# Altium schematic sheet Current_SenseSchematic.SchDoc (part 1 of 3)
size A2; SheetNumber: 1; SheetTotal: 1
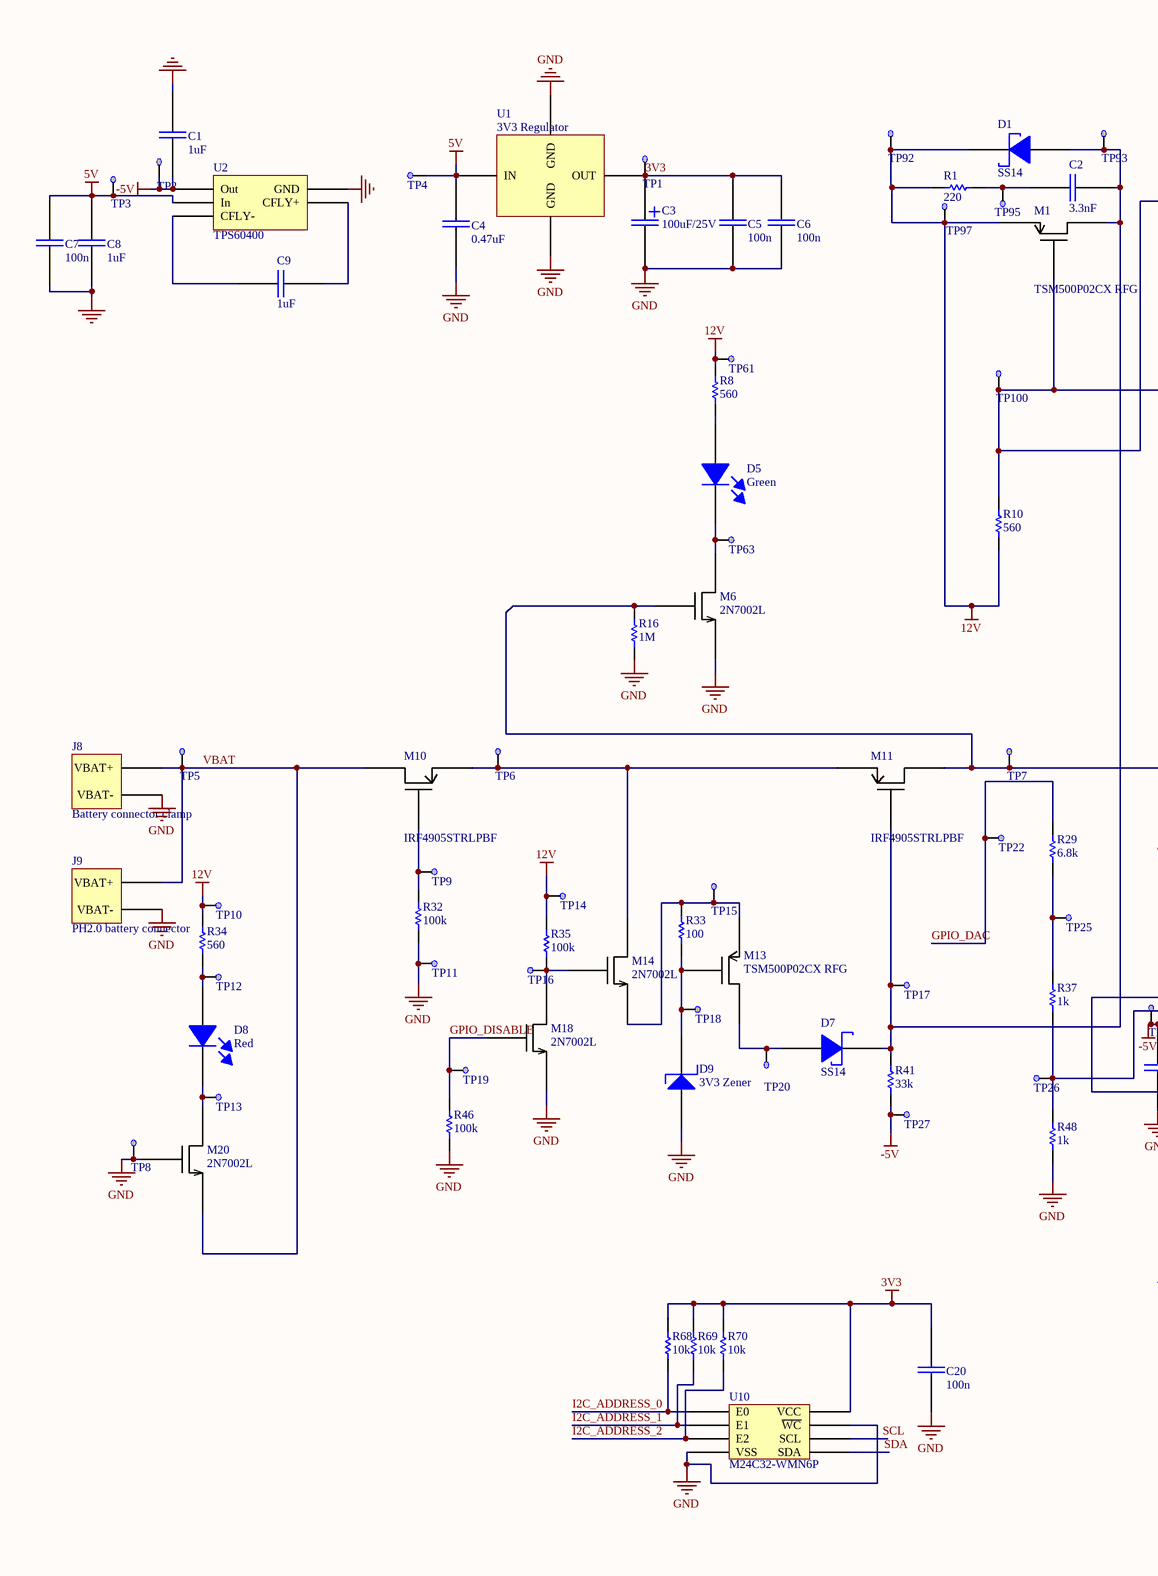
[diagram p0: Current_SenseSchematic.SchDoc, left]
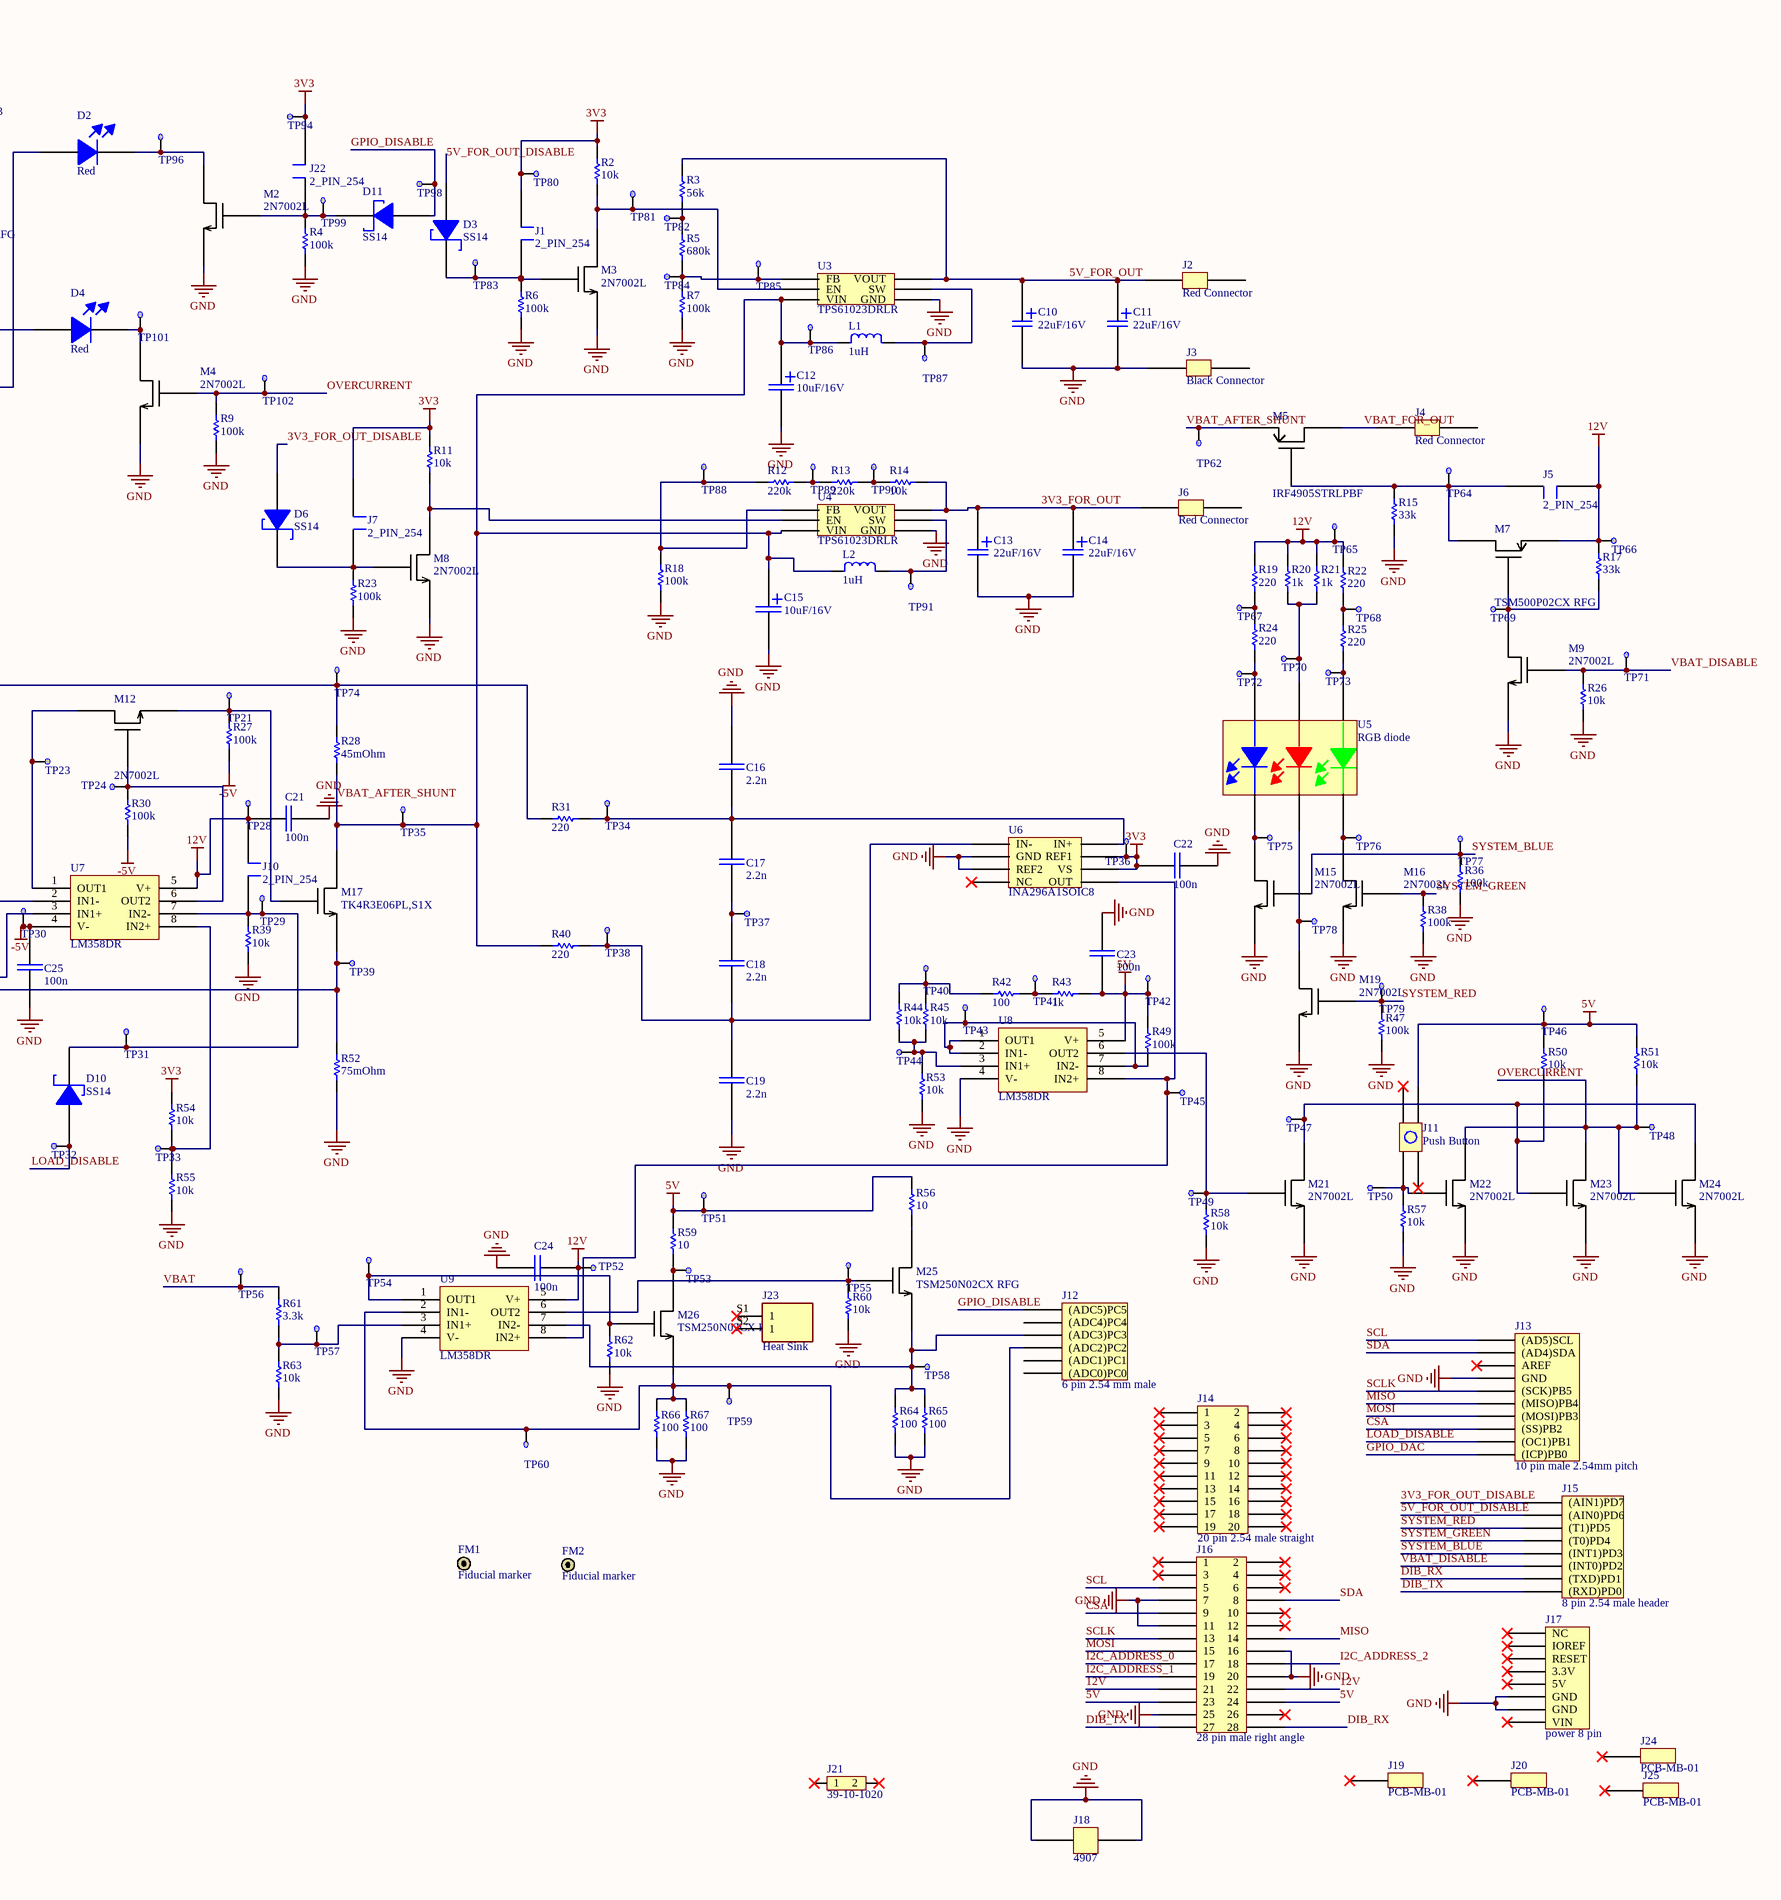
[diagram p1: Current_SenseSchematic.SchDoc, right]

## Parts
C1  1uF  [1206Capacitor]
C2  3.3nF  [1206Capacitor]
C3  100uF/25V  [CAPAE7366X60N]
C4  0.47uF  [1206Capacitor]
C5  100n  [1206Capacitor]
C6  100n  [1206Capacitor]
C7  100n  [1206Capacitor]
C8  1uF  [1206Capacitor]
C9  1uF  [1206Capacitor]
C10  22uF/16V  [22uF/16V]
C11  22uF/16V  [22uF/16V]
C12  10uF/16V  [10uF/16V Electrolytic]
C13  22uF/16V  [22uF/16V]
C14  22uF/16V  [22uF/16V]
C15  10uF/16V  [10uF/16V Electrolytic]
C16  2.2n  [1206Capacitor]
C17  2.2n  [1206Capacitor]
C18  2.2n  [1206Capacitor]
C19  2.2n  [1206Capacitor]
C20  100n  [1206Capacitor]
C21  100n  [1206Capacitor]
C22  100n  [1206Capacitor]
C23  100n  [1206Capacitor]
C24  100n  [1206Capacitor]
C25  100n  [1206Capacitor]
D1  SS14  [DIOM5026X23N]
D2  Red  [RED]
D3  SS14  [DIOM5026X23N]
D4  Red  [RED]
D5  Green  [Green]
D6  SS14  [DIOM5026X23N]
D7  SS14  [DIOM5026X23N]
D8  Red  [RED]
D9  3V3 Zener  [DIOMELF3515N]
D10  SS14  [DIOM5026X23N]
D11  SS14  [DIOM5026X23N]
FM1  Fiducial marker  [Fiducal Marker]  (net tie, no BOM)
FM2  Fiducial marker  [Fiducal Marker]  (net tie, no BOM)
J1  2_PIN_254  [2_PIN_2.54mm]
J2  Red Connector  [RED CONNECTOR]
J3  Black Connector  [BLACK CONNECTOR]
J4  Red Connector  [RED CONNECTOR]
J5  2_PIN_254  [2_PIN_2.54mm]
J6  Red Connector  [RED CONNECTOR]
J7  2_PIN_254  [2_PIN_2.54mm]
J8  Battery connector clamp  [2.54mm CLAMP connector]
J9  PH2.0 battery connector  [PH2.0 connector]
J10  2_PIN_254  [2_PIN_2.54mm]
J11  Push Button  [PUSH_BUTTON]
J12  6 pin 2.54 mm male  [6_pin_header_male_2_54]
J13  10 pin male 2.54mm pitch  [10_pin_header_male_2_54]
J14  20 pin 2.54 male straight  [20_pin_header_angled_female_2_54_mm]
J15  8 pin 2.54 male header  [8_pin_header_male_2_54]
J16  28 pin male right angle  [28_Pin_header_right_angle]
J17  power 8 pin  [8_pin_header_male_2_54]
J18  4907  [4907_footprint]
J19  PCB-MB-01  [PCB-MB-01]
J20  PCB-MB-01  [PCB-MB-01]
J21  39-10-1020  [39-30-1020]
J22  2_PIN_254  [2_PIN_2.54mm]
J23  Heat Sink  [HEAT_SINK]
J24  PCB-MB-01  [PCB-MB-01]
J25  PCB-MB-01  [PCB-MB-01]
L1  1uH  [PA4333_7.4x6.8x3.2mm]
L2  1uH  [PA4333_7.4x6.8x3.2mm]
M1  TSM500P02CX RFG  [SOT95P240X100-3N]
M2  2N7002L  [SOT95P240X100-3N]
M3  2N7002L  [SOT95P240X100-3N]
M4  2N7002L  [SOT95P240X100-3N]
M5  IRF4905STRLPBF  [DPAK254P1524X483-3L]
M6  2N7002L  [SOT95P240X100-3N]
M7  TSM500P02CX RFG  [SOT95P240X100-3N]
M8  2N7002L  [SOT95P240X100-3N]
M9  2N7002L  [SOT95P240X100-3N]
M10  IRF4905STRLPBF  [DPAK254P1524X483-3L]
M11  IRF4905STRLPBF  [DPAK254P1524X483-3L]
M12  2N7002L  [SOT95P240X100-3N]
M13  TSM500P02CX RFG  [SOT95P240X100-3N]
M14  2N7002L  [SOT95P240X100-3N]
M15  2N7002L  [SOT95P240X100-3N]
M16  2N7002L  [SOT95P240X100-3N]
M17  TK4R3E06PL,S1X  [TO-220-3]
M18  2N7002L  [SOT95P240X100-3N]
M19  2N7002L  [SOT95P240X100-3N]
M20  2N7002L  [SOT95P240X100-3N]
M21  2N7002L  [SOT95P240X100-3N]
M22  2N7002L  [SOT95P240X100-3N]
M23  2N7002L  [SOT95P240X100-3N]
M24  2N7002L  [SOT95P240X100-3N]
M25  TSM250N02CX RFG  [SOT95P240X100-3N]
M26  TSM250N02CX RFG  [SOT95P240X100-3N]
R1  220  [RESISTOR1206]
R2  10k  [RESISTOR1206]
R3  56k  [RESISTOR1206]
R4  100k  [RESISTOR1206]
R5  680k  [RESISTOR1206]
R6  100k  [RESISTOR1206]
R7  100k  [RESISTOR1206]
R8  560  [RESISTOR1206]
R9  100k  [RESISTOR1206]
R10  560  [RESISTOR1206]
R11  10k  [RESISTOR1206]
R12  220k  [RESISTOR1206]
R13  220k  [RESISTOR1206]
R14  10k  [RESISTOR1206]
R15  33k  [RESISTOR1206]
R16  1M  [RESISTOR1206]
R17  33k  [RESISTOR1206]
R18  100k  [RESISTOR1206]
R19  220  [RESISTOR1206]
R20  1k  [RESISTOR1206]
R21  1k  [RESISTOR1206]
R22  220  [RESISTOR1206]
R23  100k  [RESISTOR1206]
R24  220  [RESISTOR1206]
R25  220  [RESISTOR1206]
R26  10k  [RESISTOR1206]
R27  100k  [RESISTOR1206]
R28  45mOhm  [RESISTOR1206]
R29  6.8k  [RESISTOR1206]
R30  100k  [RESISTOR1206]
R31  220  [RESISTOR1206]
R32  100k  [RESISTOR1206]
R33  100  [RESISTOR1206]
R34  560  [RESISTOR1206]
R35  100k  [RESISTOR1206]
R36  100k  [RESISTOR1206]
R37  1k  [RESISTOR1206]
R38  100k  [RESISTOR1206]
R39  10k  [RESISTOR1206]
R40  220  [RESISTOR1206]
R41  33k  [RESISTOR1206]
R42  100  [RESISTOR1206]
R43  1k  [RESISTOR1206]
R44  10k  [RESISTOR1206]
R45  10k  [RESISTOR1206]
R46  100k  [RESISTOR1206]
R47  100k  [RESISTOR1206]
R48  1k  [RESISTOR1206]
R49  100k  [RESISTOR1206]
R50  10k  [RESISTOR1206]
R51  10k  [RESISTOR1206]
R52  75mOhm  [RESISTOR2512]
R53  10k  [RESISTOR1206]
R54  10k  [RESISTOR1206]
R55  10k  [RESISTOR1206]
R56  10  [RESISTOR1206]
R57  10k  [RESISTOR1206]
R58  10k  [RESISTOR1206]
R59  10  [RESISTOR1206]
R60  10k  [RESISTOR1206]
R61  3.3k  [RESISTOR1206]
R62  10k  [RESISTOR1206]
R63  10k  [RESISTOR1206]
R64  100  [RESISTOR1206]
R65  100  [RESISTOR1206]
R66  100  [RESISTOR1206]
R67  100  [RESISTOR1206]
R68  10k  [RESISTOR1206]
R69  10k  [RESISTOR1206]
R70  10k  [RESISTOR1206]
TP1  TestPoint  [TestPoint]  (value not drawn)  (net tie, no BOM)
TP2  TestPoint  [TestPoint]  (value not drawn)  (net tie, no BOM)
TP3  TestPoint  [TestPoint]  (value not drawn)  (net tie, no BOM)
TP4  TestPoint  [TestPoint]  (value not drawn)  (net tie, no BOM)
TP5  TestPoint  [TestPoint]  (value not drawn)  (net tie, no BOM)
TP6  TestPoint  [TestPoint]  (value not drawn)  (net tie, no BOM)
TP7  TestPoint  [TestPoint]  (value not drawn)  (net tie, no BOM)
TP8  TestPoint  [TestPoint]  (value not drawn)  (net tie, no BOM)
TP9  TestPoint  [TestPoint]  (value not drawn)  (net tie, no BOM)
TP10  TestPoint  [TestPoint]  (value not drawn)  (net tie, no BOM)
TP11  TestPoint  [TestPoint]  (value not drawn)  (net tie, no BOM)
TP12  TestPoint  [TestPoint]  (value not drawn)  (net tie, no BOM)
TP13  TestPoint  [TestPoint]  (value not drawn)  (net tie, no BOM)
TP14  TestPoint  [TestPoint]  (value not drawn)  (net tie, no BOM)
TP15  TestPoint  [TestPoint]  (value not drawn)  (net tie, no BOM)
TP16  TestPoint  [TestPoint]  (value not drawn)  (net tie, no BOM)
TP17  TestPoint  [TestPoint]  (value not drawn)  (net tie, no BOM)
TP18  TestPoint  [TestPoint]  (value not drawn)  (net tie, no BOM)
TP19  TestPoint  [TestPoint]  (value not drawn)  (net tie, no BOM)
TP20  TestPoint  [TestPoint]  (value not drawn)  (net tie, no BOM)
TP21  TestPoint  [TestPoint]  (value not drawn)  (net tie, no BOM)
TP22  TestPoint  [TestPoint]  (value not drawn)  (net tie, no BOM)
TP23  TestPoint  [TestPoint]  (value not drawn)  (net tie, no BOM)
TP24  TestPoint  [TestPoint]  (value not drawn)  (net tie, no BOM)
TP25  TestPoint  [TestPoint]  (value not drawn)  (net tie, no BOM)
TP26  TestPoint  [TestPoint]  (value not drawn)  (net tie, no BOM)
TP27  TestPoint  [TestPoint]  (value not drawn)  (net tie, no BOM)
TP28  TestPoint  [TestPoint]  (value not drawn)  (net tie, no BOM)
TP29  TestPoint  [TestPoint]  (value not drawn)  (net tie, no BOM)
TP30  TestPoint  [TestPoint]  (value not drawn)  (net tie, no BOM)
TP31  TestPoint  [TestPoint]  (value not drawn)  (net tie, no BOM)
TP32  TestPoint  [TestPoint]  (value not drawn)  (net tie, no BOM)
TP33  TestPoint  [TestPoint]  (value not drawn)  (net tie, no BOM)
TP34  TestPoint  [TestPoint]  (value not drawn)  (net tie, no BOM)
TP35  TestPoint  [TestPoint]  (value not drawn)  (net tie, no BOM)
TP36  TestPoint  [TestPoint]  (value not drawn)  (net tie, no BOM)
TP37  TestPoint  [TestPoint]  (value not drawn)  (net tie, no BOM)
TP38  TestPoint  [TestPoint]  (value not drawn)  (net tie, no BOM)
TP39  TestPoint  [TestPoint]  (value not drawn)  (net tie, no BOM)
TP40  TestPoint  [TestPoint]  (value not drawn)  (net tie, no BOM)
TP41  TestPoint  [TestPoint]  (value not drawn)  (net tie, no BOM)
TP42  TestPoint  [TestPoint]  (value not drawn)  (net tie, no BOM)
TP43  TestPoint  [TestPoint]  (value not drawn)  (net tie, no BOM)
TP44  TestPoint  [TestPoint]  (value not drawn)  (net tie, no BOM)
TP45  TestPoint  [TestPoint]  (value not drawn)  (net tie, no BOM)
TP46  TestPoint  [TestPoint]  (value not drawn)  (net tie, no BOM)
TP47  TestPoint  [TestPoint]  (value not drawn)  (net tie, no BOM)
TP48  TestPoint  [TestPoint]  (value not drawn)  (net tie, no BOM)
TP49  TestPoint  [TestPoint]  (value not drawn)  (net tie, no BOM)
TP50  TestPoint  [TestPoint]  (value not drawn)  (net tie, no BOM)
TP51  TestPoint  [TestPoint]  (value not drawn)  (net tie, no BOM)
TP52  TestPoint  [TestPoint]  (value not drawn)  (net tie, no BOM)
TP53  TestPoint  [TestPoint]  (value not drawn)  (net tie, no BOM)
TP54  TestPoint  [TestPoint]  (value not drawn)  (net tie, no BOM)
TP55  TestPoint  [TestPoint]  (value not drawn)  (net tie, no BOM)
TP56  TestPoint  [TestPoint]  (value not drawn)  (net tie, no BOM)
TP57  TestPoint  [TestPoint]  (value not drawn)  (net tie, no BOM)
TP58  TestPoint  [TestPoint]  (value not drawn)  (net tie, no BOM)
TP59  TestPoint  [TestPoint]  (value not drawn)  (net tie, no BOM)
TP60  TestPoint  [TestPoint]  (value not drawn)  (net tie, no BOM)
TP61  TestPoint  [TestPoint]  (value not drawn)  (net tie, no BOM)
TP62  TestPoint  [TestPoint]  (value not drawn)  (net tie, no BOM)
TP63  TestPoint  [TestPoint]  (value not drawn)  (net tie, no BOM)
TP64  TestPoint  [TestPoint]  (value not drawn)  (net tie, no BOM)
TP65  TestPoint  [TestPoint]  (value not drawn)  (net tie, no BOM)
TP66  TestPoint  [TestPoint]  (value not drawn)  (net tie, no BOM)
TP67  TestPoint  [TestPoint]  (value not drawn)  (net tie, no BOM)
TP68  TestPoint  [TestPoint]  (value not drawn)  (net tie, no BOM)
TP69  TestPoint  [TestPoint]  (value not drawn)  (net tie, no BOM)
TP70  TestPoint  [TestPoint]  (value not drawn)  (net tie, no BOM)
TP71  TestPoint  [TestPoint]  (value not drawn)  (net tie, no BOM)
TP72  TestPoint  [TestPoint]  (value not drawn)  (net tie, no BOM)
TP73  TestPoint  [TestPoint]  (value not drawn)  (net tie, no BOM)
TP74  TestPoint  [TestPoint]  (value not drawn)  (net tie, no BOM)
TP75  TestPoint  [TestPoint]  (value not drawn)  (net tie, no BOM)
TP76  TestPoint  [TestPoint]  (value not drawn)  (net tie, no BOM)
TP77  TestPoint  [TestPoint]  (value not drawn)  (net tie, no BOM)
TP78  TestPoint  [TestPoint]  (value not drawn)  (net tie, no BOM)
TP79  TestPoint  [TestPoint]  (value not drawn)  (net tie, no BOM)
TP80  TestPoint  [TestPoint]  (value not drawn)  (net tie, no BOM)
TP81  TestPoint  [TestPoint]  (value not drawn)  (net tie, no BOM)
TP82  TestPoint  [TestPoint]  (value not drawn)  (net tie, no BOM)
TP83  TestPoint  [TestPoint]  (value not drawn)  (net tie, no BOM)
TP84  TestPoint  [TestPoint]  (value not drawn)  (net tie, no BOM)
TP85  TestPoint  [TestPoint]  (value not drawn)  (net tie, no BOM)
TP86  TestPoint  [TestPoint]  (value not drawn)  (net tie, no BOM)
TP87  TestPoint  [TestPoint]  (value not drawn)  (net tie, no BOM)
TP88  TestPoint  [TestPoint]  (value not drawn)  (net tie, no BOM)
TP89  TestPoint  [TestPoint]  (value not drawn)  (net tie, no BOM)
TP90  TestPoint  [TestPoint]  (value not drawn)  (net tie, no BOM)
TP91  TestPoint  [TestPoint]  (value not drawn)  (net tie, no BOM)
TP92  TestPoint  [TestPoint]  (value not drawn)  (net tie, no BOM)
TP93  TestPoint  [TestPoint]  (value not drawn)  (net tie, no BOM)
TP94  TestPoint  [TestPoint]  (value not drawn)  (net tie, no BOM)
TP95  TestPoint  [TestPoint]  (value not drawn)  (net tie, no BOM)
TP96  TestPoint  [TestPoint]  (value not drawn)  (net tie, no BOM)
TP97  TestPoint  [TestPoint]  (value not drawn)  (net tie, no BOM)
TP98  TestPoint  [TestPoint]  (value not drawn)  (net tie, no BOM)
TP99  TestPoint  [TestPoint]  (value not drawn)  (net tie, no BOM)
TP100  TestPoint  [TestPoint]  (value not drawn)  (net tie, no BOM)
TP101  TestPoint  [TestPoint]  (value not drawn)  (net tie, no BOM)
TP102  TestPoint  [TestPoint]  (value not drawn)  (net tie, no BOM)
U1  3V3 Regulator  [SOT230P700X180-4N]
U2  TPS60400  [SOT95P280X135-5N]
U3  TPS61023DRLR  [SOT563]
U4  TPS61023DRLR  [SOT563]
U5  RGB diode  [RGBDIODE]
U6  INA296A1SOIC8  [SOIC127P600X175-8N]
U7  LM358DR  [SOIC127P600X175-8N]
U8  LM358DR  [SOIC127P600X175-8N]
U9  LM358DR  [SOIC127P600X175-8N]
U10  M24C32-WMN6P  [SOIC127P600X175-8N]

## Nets
3V3: C3.1(C-) C5.2 C6.2 C20.2 C22.1 J1.1 J7.1 J22.2 R2.2 R11.2 R54.2 R68.2 R69.2 R70.2 TP1.1(Test_Point) TP36.1(Test_Point) TP80.1(Test_Point) TP94.1(Test_Point) U1.3(OUT) U6.6(VS) U6.7(REF1) U10.8(VCC)
5V: C4.2 C7.2 C8.2 C23.1 J11.4 J16.23 J16.24 R43.1 R49.2 R50.2 R51.2 R56.2 R59.2 TP3.1(Test_Point) TP4.1(Test_Point) TP42.1(Test_Point) TP46.1(Test_Point) TP51.1(Test_Point) U1.1(IN) U2.2(In) U8.5(V+)
12V: C21.2 C24.2 D1.2(K) J5.1 J10.1 J16.21 J16.22 M1.3(S) M7.3(S) R1.1 R8.2 R10.1 R17.2 R19.2 R20.2 R21.2 R22.2 R34.2 R35.2 TP10.1(Test_Point) TP14.1(Test_Point) TP28.1(Test_Point) TP52.1(Test_Point) TP61.1(Test_Point) TP65.1(Test_Point) TP66.1(Test_Point) TP92.1(Test_Point) TP97.1(Test_Point) U7.5(V+) U9.5(V+)
-5V: C1.1 C25.2 R27.1 R30.1 R41.1 TP2.1(Test_Point) TP27.1(Test_Point) TP30.1(Test_Point) U2.1(Out) U7.4(V-)
GND: C1.2 C3.2(C+) C4.1 C5.1 C6.1 C7.1 C8.1 C10.2(C+) C11.2(C+) C12.2(C+) C13.2(C+) C14.2(C+) C15.2(C+) C16.2 C19.1 C20.1 C21.1 C22.2 C23.2 C24.1 C25.1 D9.1(A) J3.2 J8.2(VBAT-) J9.2(VBAT-) J13.4(GND) J16.7 J16.11 J16.16 J16.20 J16.25 J17.6(GND) J17.7(GND) J18.1 J18.2 M2.2(S) M3.2(S) M4.2(S) M6.2(S) M8.2(S) M9.2(S) M15.2(S) M16.2(S) M18.2(S) M19.2(S) M20.1(G) M21.2(S) M22.2(S) M23.2(S) M24.2(S) R4.1 R6.1 R7.1 R9.1 R15.1 R16.1 R18.1 R23.1 R26.1 R32.1 R36.1 R38.1 R39.1 R46.1 R47.1 R48.1 R52.1 R53.1 R55.1 R57.1 R58.1 R60.1 R62.1 R63.1 R64.1 R65.1 R66.1 R67.1 TP8.1(Test_Point) TP11.1(Test_Point) U1.2(GND) U1.4(GND) U2.4(GND) U3.4(GND) U4.4(GND) U6.2(GND) U6.3(REF2) U8.4(V-) U9.4(V-) U10.4(VSS) U10.7(~{WC})
3V3_FOR_OUT: C13.1(C-) C14.1(C-) J6.2 R14.2 U4.6(VOUT)
3V3_FOR_OUT_DISABLE: D6.1(A) J15.8((AIN1)PD7)
5V_FOR_OUT: C10.1(C-) C11.1(C-) J2.2 R3.2 U3.6(VOUT)
5V_FOR_OUT_DISABLE: D3.1(A) J15.7((AIN0)PD6)
CSA: J13.8((SS)PB2) J16.9
DIB_RX: J15.2((TXD)PD1) J16.28
DIB_TX: J15.1((RXD)PD0) J16.27
GPIO_DAC: J13.10((ICP)PB0) R29.2 TP22.1(Test_Point)
GPIO_DISABLE: D11.1(A) J12.6((ADC5)PC5) M18.1(G) R46.2 TP19.1(Test_Point) TP98.1(Test_Point)
I2C_ADDRESS_0: J16.17 R68.1 U10.1(E0)
I2C_ADDRESS_1: J16.19 R69.1 U10.2(E1)
I2C_ADDRESS_2: J16.18 R70.1 U10.3(E2)
LOAD_DISABLE: D10.1(A) J13.9((OC1)PB1) TP32.1(Test_Point)
MISO: J13.6((MISO)PB4) J16.14
MOSI: J13.7((MOSI)PB3) J16.15
OVERCURRENT: M4.1(G) M22.3(D) M23.3(D) M24.1(G) R9.2 R51.1 TP48.1(Test_Point) TP102.1(Test_Point)
SCL: J13.1((AD5)SCL) J16.5 U10.6(SCL)
SCLK: J13.5((SCK)PB5) J16.13
SDA: J13.2((AD4)SDA) J16.8 U10.5(SDA)
SYSTEM_BLUE: J15.4((INT1)PD3) M15.1(G) R36.2 TP77.1(Test_Point)
SYSTEM_GREEN: J15.5((T0)PD4) M16.1(G) R38.2
SYSTEM_RED: J15.6((T1)PD5) M19.1(G) R47.2 TP79.1(Test_Point)
VBAT: J8.1(VBAT+) J9.1(VBAT+) M10.4(D) M20.2(S) R61.2 TP5.1(Test_Point) TP56.1(Test_Point)
VBAT_AFTER_SHUNT: C12.1(C-) C15.1(C-) L1.1 L2.1 M5.3(S) M17.2(D) R28.1 R40.1 TP35.1(Test_Point) TP62.1(Test_Point) TP86.1(Test_Point) U3.3(VIN) U4.3(VIN)
VBAT_DISABLE: J15.3((INT0)PD2) M9.1(G) R26.2 TP71.1(Test_Point)
VBAT_FOR_OUT: J4.2 M5.4(D)
NetC2_1: C2.1 R1.2 TP95.1(Test_Point)
NetC2_2: C2.2 D1.1(A) D7.2(K) M1.2(D) M11.1(G) R41.2 TP17.1(Test_Point) TP93.1(Test_Point)
NetC9_1: C9.1 U2.3(CFLY-)
NetC9_2: C9.2 U2.5(CFLY+)
NetC16_1: C16.1 C17.2 R31.2 TP34.1(Test_Point) U6.8(IN+)
NetC17_1: C17.1 C18.2 TP37.1(Test_Point)
NetC18_1: C18.1 C19.2 R40.2 TP38.1(Test_Point) U6.1(IN-)
NetD2_1: D2.1(K) M2.3(D) TP96.1(Test_Point)
NetD2_2: D2.2(A) D4.2(A) M1.1(G) R10.2 TP100.1(Test_Point)
NetD3_2: D3.2(K) J1.2 M3.1(G) R6.2 TP83.1(Test_Point)
NetD4_1: D4.1(K) M4.3(D) TP101.1(Test_Point)
NetD5_1: D5.1(K) M6.3(D) TP63.1(Test_Point)
NetD5_2: D5.2(A) R8.1
NetD6_2: D6.2(K) J7.2 M8.1(G) R23.2
NetD7_1: D7.1(A) M13.2(D) TP20.1(Test_Point)
NetD8_1: D8.1(K) M20.3(D) TP13.1(Test_Point)
NetD8_2: D8.2(A) R34.1 TP12.1(Test_Point)
NetD9_2: D9.2(K) M13.1(G) R33.1 TP18.1(Test_Point)
NetD10_2: D10.2(K) J10.2 R39.2 TP29.1(Test_Point) TP31.1(Test_Point) U7.7(IN2-)
NetD11_2: D11.2(K) J22.1 M2.1(G) R4.2 TP99.1(Test_Point)
NetJ5_2: J5.2 M5.1(G) M7.2(D) R15.2 TP64.1(Test_Point)
NetJ11_1: J11.1 M22.1(G) R57.2 TP50.1(Test_Point)
NetJ12_3: J12.3((ADC2)PC2) M26.2(S) R66.2 R67.2 TP59.1(Test_Point) TP60.1(Test_Point) U9.2(IN1-)
NetJ12_4: J12.4((ADC3)PC3) M25.2(S) R64.2 R65.2 TP58.1(Test_Point) U9.7(IN2-)
NetL1_2: L1.2 TP87.1(Test_Point) U3.5(SW)
NetL2_2: L2.2 TP91.1(Test_Point) U4.5(SW)
NetM3_3: M3.3(D) R2.1 TP81.1(Test_Point) U3.2(EN)
NetM6_1: M6.1(G) M11.4(D) R16.2 R28.2 R31.1 TP7.1(Test_Point) TP74.1(Test_Point)
NetM7_1: M7.1(G) M9.3(D) R17.1 TP69.1(Test_Point)
NetM8_3: M8.3(D) R11.1 U4.2(EN)
NetM10_1: M10.1(G) R32.2 TP9.1(Test_Point)
NetM10_3: M10.3(S) M11.3(S) M14.3(D) TP6.1(Test_Point)
NetM12_1: M12.1(G) R30.2 TP24.1(Test_Point) U7.6(OUT2)
NetM12_2: M12.2(S) M17.1(G) R27.2 TP21.1(Test_Point)
NetM12_3: M12.3(D) TP23.1(Test_Point) U7.1(OUT1)
NetM13_3: M13.3(S) M14.2(S) R33.2 TP15.1(Test_Point)
NetM14_1: M14.1(G) M18.3(D) R35.1 TP16.1(Test_Point)
NetM15_3: M15.3(D) TP75.1(Test_Point) U5.1(BK)
NetM16_3: M16.3(D) TP76.1(Test_Point) U5.5(GK)
NetM17_3: M17.3(S) R52.2 TP39.1(Test_Point) U7.2(IN1-)
NetM19_3: M19.3(D) TP78.1(Test_Point) U5.3(RK)
NetM21_1: M21.1(G) R58.2 TP49.1(Test_Point) U8.6(OUT2)
NetM21_3: M21.3(D) M23.1(G) M24.3(D) R50.1 TP47.1(Test_Point)
NetM25_1: M25.1(G) R60.2 TP55.1(Test_Point) U9.6(OUT2)
NetM25_3: M25.3(D) R56.1
NetM26_1: M26.1(G) R62.2 TP54.1(Test_Point) U9.1(OUT1)
NetM26_3: M26.3(D) R59.1 TP53.1(Test_Point)
NetR3_1: R3.1 R5.2 TP82.1(Test_Point)
NetR5_1: R5.1 R7.2 TP84.1(Test_Point) TP85.1(Test_Point) U3.1(FB)
NetR12_1: R12.1 R18.2 TP88.1(Test_Point) U4.1(FB)
NetR12_2: R12.2 R13.1 TP89.1(Test_Point)
NetR13_2: R13.2 R14.1 TP90.1(Test_Point)
NetR19_1: R19.1 R24.2 TP67.1(Test_Point)
NetR20_1: R20.1 R21.1 TP70.1(Test_Point) U5.4(RA)
NetR22_1: R22.1 R25.2 TP68.1(Test_Point)
NetR24_1: R24.1 TP72.1(Test_Point) U5.2(BA)
NetR25_1: R25.1 TP73.1(Test_Point) U5.6(GA)
NetR29_1: R29.1 R37.2 TP25.1(Test_Point)
NetR37_1: R37.1 R48.2 TP26.1(Test_Point) U7.3(IN1+)
NetR42_1: R42.1 R44.2 R45.2 TP40.1(Test_Point)
NetR42_2: R42.2 R43.2 TP41.1(Test_Point)
NetR44_1: R44.1 R45.1 R53.2 TP44.1(Test_Point) U8.3(IN1+)
NetR49_1: R49.1 TP43.1(Test_Point) U8.1(OUT1) U8.2(IN1-) U8.7(IN2-)
NetR54_1: R54.1 R55.2 TP33.1(Test_Point) U7.8(IN2+)
NetR61_1: R61.1 R63.2 TP57.1(Test_Point) U9.3(IN1+)
NetTP45_1: TP45.1(Test_Point) U6.5(OUT) U8.8(IN2+) U9.8(IN2+)

Not connected (* = marked no-connect by the designer): J2 1; J3 1; J4 1; J6 1; J11 2* 3*; J12 1((ADC0)PC0) 2((ADC1)PC1) 5((ADC4)PC4_); J13 3(AREF)*; J14 1* 2* 3* 4* 5* 6* 7* 8* 9* 10* 11* 12* 13* 14* 15* 16* 17* 18* 19* 20*; J16 1* 2* 3* 4* 6* 10* 12* 26*; J17 1(NC)* 2(IOREF)* 3(RESET)* 4(3.3V)* 5(5V)* 8(VIN)*; J19 1*; J20 1*; J21 1* 2*; J23 S1(1)* S2(1)*; J24 1*; J25 1*; U6 4(NC)*